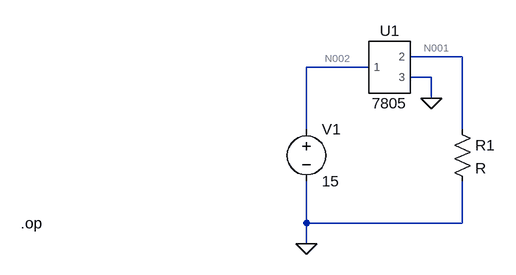
[diagram p0: schematic 7805 Reg.asc]
7805 Reg.asc, the LTspice schematic file:
Version 4
SHEET 1 880 680
WIRE 304 96 224 96
WIRE 160 112 64 112
WIRE 256 128 224 128
WIRE 256 160 256 128
WIRE 64 208 64 112
WIRE 304 208 304 96
WIRE 64 352 64 288
WIRE 304 352 304 288
WIRE 304 352 64 352
WIRE 64 384 64 352
FLAG 64 384 0
FLAG 256 160 0
SYMBOL 7805 192 112 R0
SYMATTR InstName U1
SYMBOL voltage 64 192 R0
WINDOW 123 0 0 Left 0
WINDOW 39 0 0 Left 0
SYMATTR InstName V1
SYMATTR Value 15
SYMBOL res 288 192 R0
SYMATTR InstName R1
TEXT -376 352 Left 2 !.op

The netlist it stands for:
* 7805 Reg.asc
XU1 N002 N001 0 7805  ; pins 1 2 3
V1 N002 0 15
R1 N001 0 R
.op
.lib C:\Users\srich\Downloads\IC7805 LTSpice netlist.cir
.backanno
.end

* Results of the author's LTspice run, read from the files saved beside the schematic
* Operating Point:
*   V(n002) = 15 V
*   V(n001) = 5.144 V
*   I(R1) = 5.144 mA
*   I(V1) = -9.502 mA
*   Ix(u1:1) = 9.502 mA
*   Ix(u1:2) = -5.144 mA
*   Ix(u1:3) = -4.358 mA
* From the log:
*   Semiconductor Device Operating Points:
*                           --- Diodes ---
*   Name:    d:u1:z1     d:u1:r      d:u1:c-     d:u1:c+     d:u1:bl
*   Model:   u1:dz1       u1:dr     u1:dclamp   u1:dclamp    u1:dbl
*   Id:     -1.09e-04   -1.08e-04   -2.85e-12   -1.12e-11    6.35e-04
*   Vd:     -1.50e+00   -1.27e+00   -2.84e+00   -1.12e+01    5.16e-02
*   Req:     2.37e+00    2.40e+00    1.00e+12    1.00e+12    3.52e+01
*   CAP:     0.00e+00    0.00e+00    0.00e+00    0.00e+00    0.00e+00
*   Name:    d:u1:c      d:u1:cl    d:u1:zfb    d:u1:dis
*   Model:    u1:dc      u1:dcl      u1:dzfb     u1:dmod
*   Id:      8.76e-03    5.91e-13   -9.86e-12   -9.87e-12
*   Vd:      1.15e+00    3.06e-10   -9.85e+00   -9.86e+00
*   Req:     4.78e+00    5.17e+02    1.00e+12    1.00e+12
*   CAP:     0.00e+00    0.00e+00    0.00e+00    0.00e+00
*                           --- Bipolar Transistors ---
*   Name:     q:u1:p      q:u1:cl
*   Model:     u1:qp     u1:qlimit
*   Ib:       1.19e-07   -5.86e-13
*   Ic:       8.76e-03    5.91e-13
*   Vbe:      5.91e-01    4.45e-03
*   Vbc:     -8.11e+00   -5.91e-01
*   Vce:      8.70e+00    5.95e-01
*   BetaDC:   7.38e+04   -1.01e+00
*   Gm:       3.39e-01    4.59e-15
*   Rpi:      2.18e+05    1.00e+12
*   Rx:       0.00e+00    0.00e+00
*   Ro:       1.81e+04    2.15e+24
*   Cbe:      0.00e+00    0.00e+00
*   Cbc:      0.00e+00    0.00e+00
*   Cjs:      0.00e+00    0.00e+00
*   BetaAC:   7.38e+04    4.59e-03
*   Cbx:      0.00e+00    0.00e+00
*   Ft:       0.00e+00    0.00e+00